# Altium schematic sheet PART5_HPI_McBSP.SchDoc: 接口及解码设计
size A3; Author: 崔 敖; 李尚文; Revision: B1.0; SheetNumber: 5
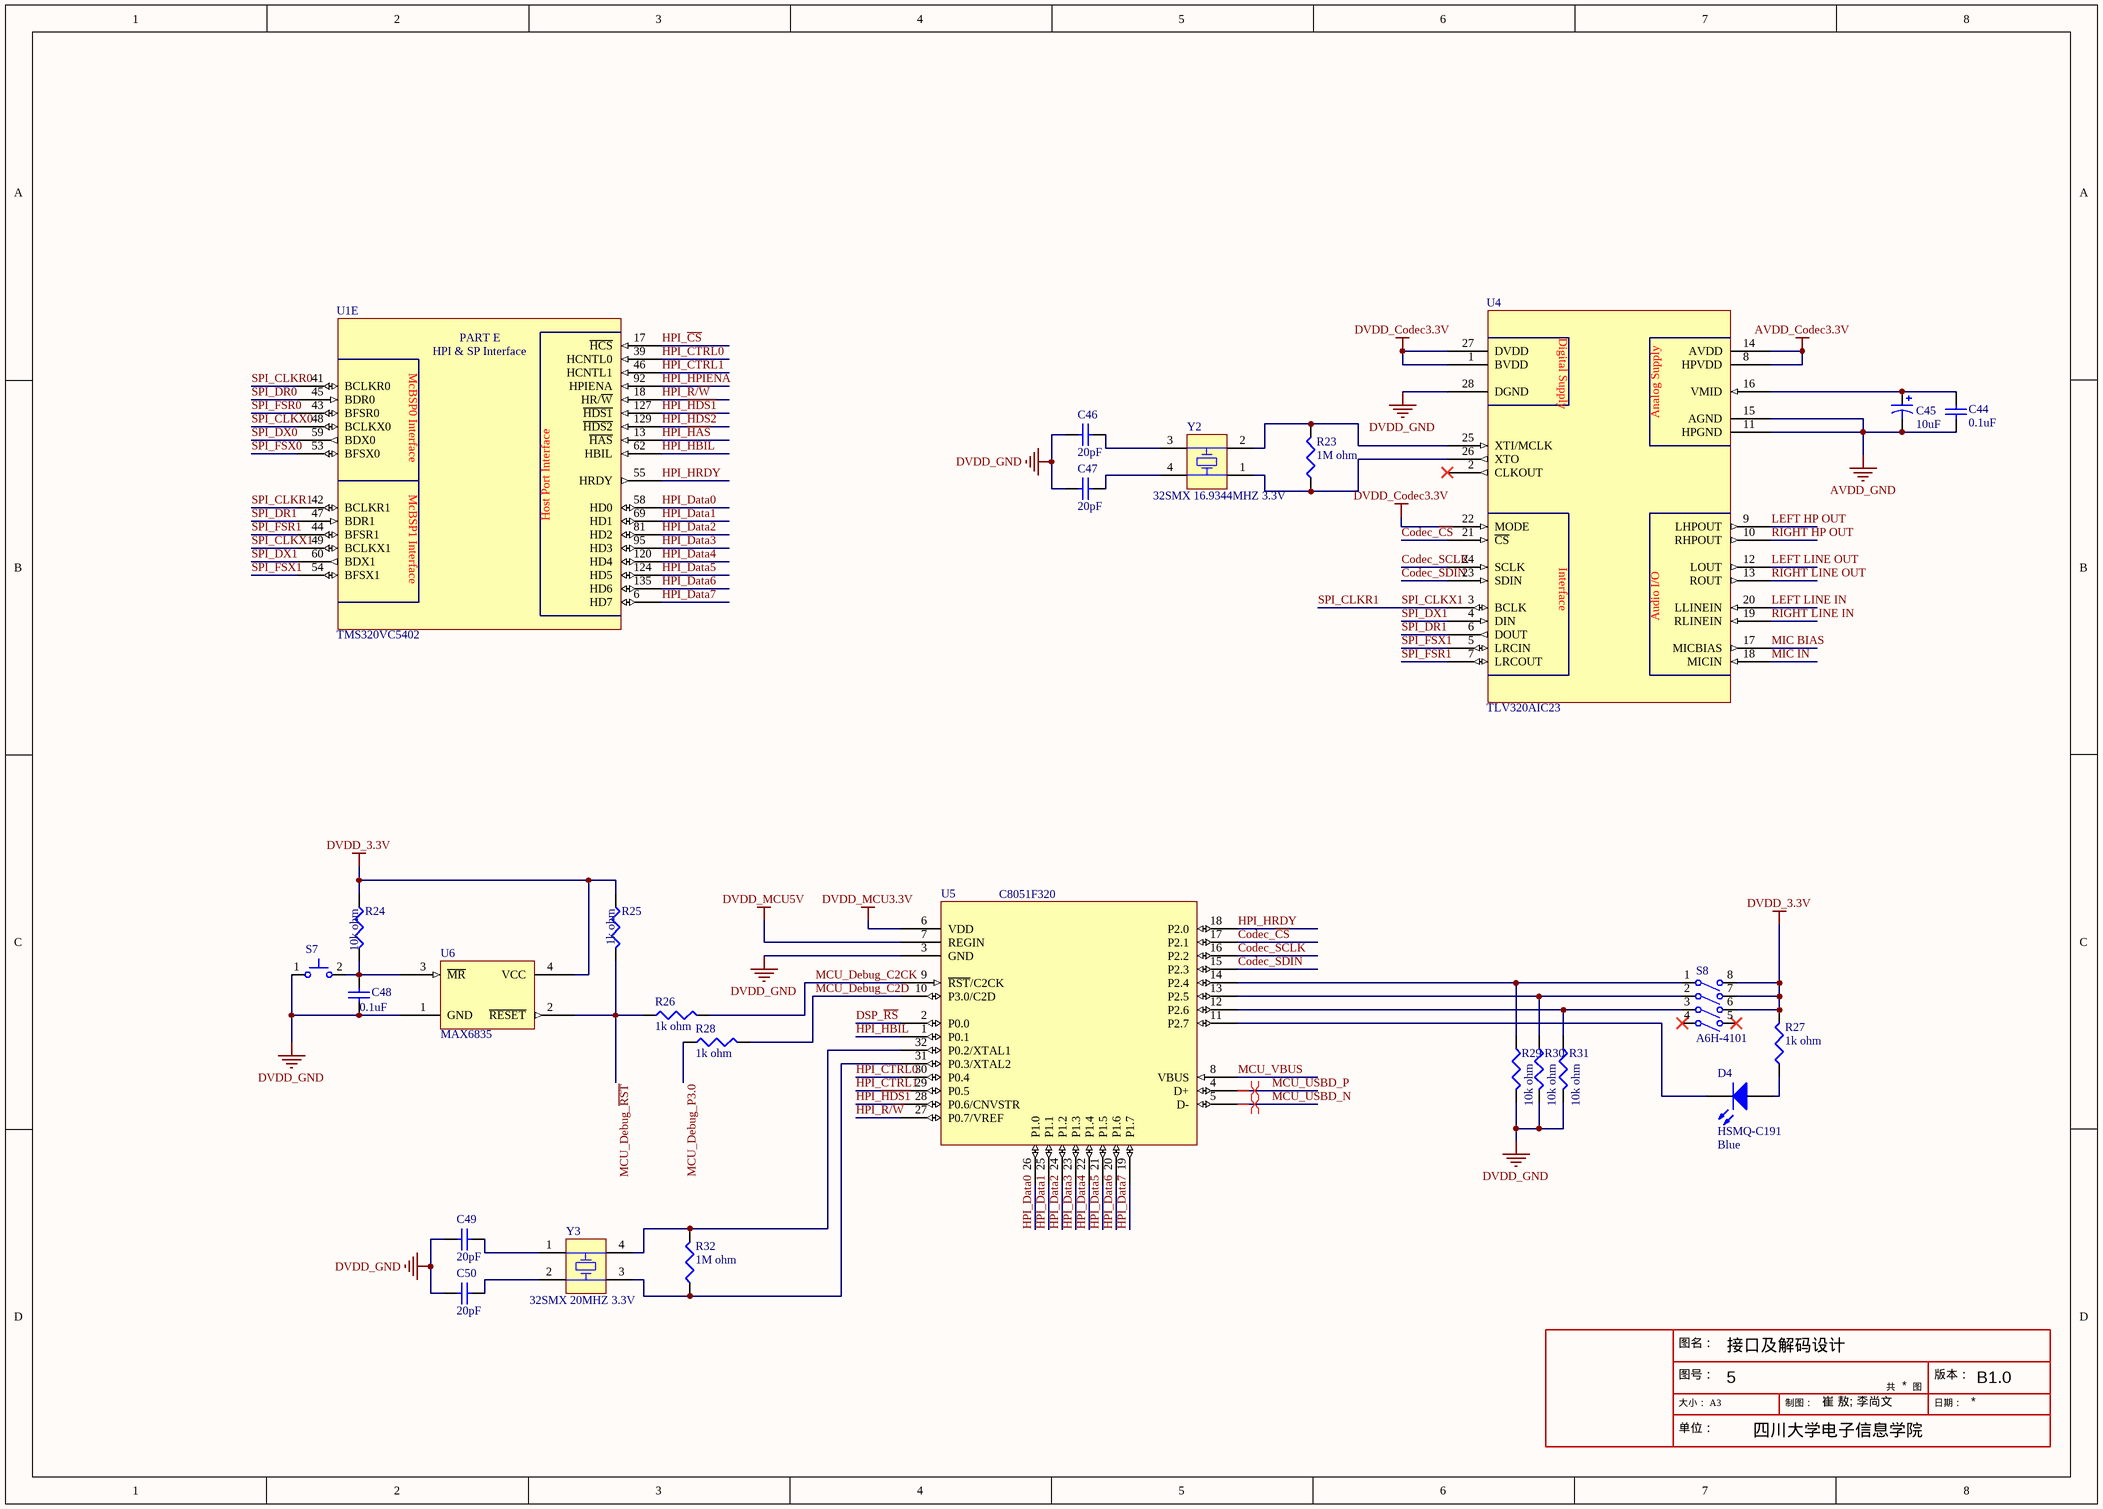
[diagram p0: PART5_HPI_McBSP.SchDoc]

## Parts
C44  value 0.1uF  [1608[0603]]  (hidden comment: Cap Semi)
C45  value 10uF  [C0805]  (hidden comment: Cap Tan)
C46  value 20pF  [1608[0603]]  (hidden comment: Cap Semi)
C47  value 20pF  [1608[0603]]  (hidden comment: Cap Semi)
C48  value 0.1uF  [1608[0603]]  (hidden comment: Cap Semi)
C49  value 20pF  [1608[0603]]  (hidden comment: Cap Semi)
C50  value 20pF  [1608[0603]]  (hidden comment: Cap Semi)
D4  HSMQ-C191  LED_Colour: Blue  [1.6X0.8X0.6]
R23  value 1M ohm  [J1-0603]  (hidden comment: Res3)
R24  value 10k ohm  [J1-0603]  (hidden comment: Res3)
R25  value 1k ohm  [J1-0603]  (hidden comment: Res3)
R26  value 1k ohm  [J1-0603]  (hidden comment: Res3)
R27  value 1k ohm  [J1-0603]  (hidden comment: Res3)
R28  value 1k ohm  [J1-0603]  (hidden comment: Res3)
R29  value 10k ohm  [J1-0603]  (hidden comment: Res3)
R30  value 10k ohm  [J1-0603]  (hidden comment: Res3)
R31  value 10k ohm  [J1-0603]  (hidden comment: Res3)
R32  value 1M ohm  [J1-0603]  (hidden comment: Res3)
S7  KSS221GLFS  [KSS-2G]  (value not drawn)
S8  A6H-4101  [A6H-4]
U1  TMS320VC5402  [TMS320VC5401_PQFP144]  (part E of 5)
U4  TLV320AIC23  [TSOP65P640X120-28N]
U5  C8051F320  [TQFP80P900X900X160-32N]
U6  MAX6835  [SC70-4]
Y2  32SMX 16.9344MHZ 3.3V  [32SMX]
Y3  32SMX 20MHZ 3.3V  [32SMX]

## Nets
AVDD_Codec3.3V: U4.8(HPVDD) U4.14(AVDD)
AVDD_GND: C44.2 C45.2 U4.11(HPGND) U4.15(AGND)
DVDD_3.3V: R24.1 R25.1 R27.2 S8.6(B3) S8.7(B2) S8.8(B1) U6.4(VCC)
DVDD_Codec3.3V: U4.1(BVDD) U4.22(MODE) U4.27(DVDD)
DVDD_GND: C46.2 C47.2 C48.2 C49.2 C50.2 R29.2 R30.2 R31.2 S7.1 U4.28(DGND) U5.3(GND) U6.1(GND)
DVDD_MCU3.3V: U5.6(VDD)
DVDD_MCU5V: U5.7(REGIN)
Codec_~{CS}: U4.21(~{CS}) U5.17(P2.1)
Codec_SCLK: U4.24(SCLK) U5.16(P2.2)
Codec_SDIN: U4.23(SDIN) U5.15(P2.3)
DSP_~{RS}: U5.2(P0.0)
HPI_~{CS}: U1.17(~{HCS})
HPI_CTRL0: U1.39(HCNTL0) U5.30(P0.4)
HPI_CTRL1: U1.46(HCNTL1) U5.29(P0.5)
HPI_Data0: U1.58(HD0) U5.26(P1.0)
HPI_Data1: U1.69(HD1) U5.25(P1.1)
HPI_Data2: U1.81(HD2) U5.24(P1.2)
HPI_Data3: U1.95(HD3) U5.23(P1.3)
HPI_Data4: U1.120(HD4) U5.22(P1.4)
HPI_Data5: U1.124(HD5) U5.21(P1.5)
HPI_Data6: U1.135(HD6) U5.20(P1.6)
HPI_Data7: U1.6(HD7) U5.19(P1.7)
HPI_~{HAS}: U1.13(~{HAS})
HPI_~{HDS1}: U1.127(~{HDS1}) U5.28(P0.6/CNVSTR)
HPI_~{HDS2}: U1.129(~{HDS2})
HPI_HBIL: U1.62(HBIL) U5.1(P0.1)
HPI_HPIENA: U1.92(HPIENA)
HPI_HRDY: U1.55(HRDY) U5.18(P2.0)
HPI_R/~{W}: U1.18(HR/~{W}) U5.27(P0.7/VREF)
LEFT HP OUT: U4.9(LHPOUT)
LEFT LINE IN: U4.20(LLINEIN)
LEFT LINE OUT: U4.12(LOUT)
MCU_Debug_C2CK: R26.2 U5.9(~{RST}/C2CK)
MCU_Debug_C2D: R28.2 U5.10(P3.0/C2D)
MCU_Debug_P3.0: R28.1
MCU_Debug_~{RST}: R25.2 R26.1 U6.2(~{RESET})
MCU_USBD_N: U5.5(D-)
MCU_USBD_P: U5.4(D+)
MCU_VBUS: U5.8(VBUS)
MIC BIAS: U4.17(MICBIAS)
MIC IN: U4.18(MICIN)
RIGHT HP OUT: U4.10(RHPOUT)
RIGHT LINE IN: U4.19(RLINEIN)
RIGHT LINE OUT: U4.13(ROUT)
SPI_CLKR0: U1.41(BCLKR0)
SPI_CLKR1: U1.42(BCLKR1) U1.49(BCLKX1) U4.3(BCLK)  [also labelled SPI_CLKX1]
SPI_CLKX0: U1.48(BCLKX0)
SPI_DR0: U1.45(BDR0)
SPI_DR1: U1.47(BDR1) U4.6(DOUT)
SPI_DX0: U1.59(BDX0)
SPI_DX1: U1.60(BDX1) U4.4(DIN)
SPI_FSR0: U1.43(BFSR0)
SPI_FSR1: U1.44(BFSR1) U4.7(LRCOUT)
SPI_FSX0: U1.53(BFSX0)
SPI_FSX1: U1.54(BFSX1) U4.5(LRCIN)
NetC44_1: C44.1 C45.1 U4.16(VMID)
NetC46_1: C46.1 Y2.3(OSC2)
NetC47_1: C47.1 Y2.4(OSC1)
NetC48_1: C48.1 R24.2 S7.2 U6.3(~{MR})
NetC49_1: C49.1 Y3.1(OSC1)
NetC50_1: C50.1 Y3.2(OSC2)
NetD4_1: D4.1(A) R27.1
NetD4_2: D4.2(K) U5.11(P2.7)
NetR23_1: R23.1 U4.26(XTO) Y2.1(OSC1)
NetR23_2: R23.2 U4.25(XTI/MCLK) Y2.2(OSC2)
NetR29_1: R29.1 S8.1(A1) U5.14(P2.4)
NetR30_1: R30.1 S8.2(A2) U5.13(P2.5)
NetR31_1: R31.1 S8.3(A3) U5.12(P2.6)
NetR32_1: R32.1 U5.31(P0.3/XTAL2) Y3.3(OSC2)
NetR32_2: R32.2 U5.32(P0.2/XTAL1) Y3.4(OSC1)

Not connected (* = marked no-connect by the designer): S8 4(A4)* 5(B4)*; U4 2(CLKOUT)*

## Layout directives
differential pair: MCU_USBD_N, MCU_USBD_P

## Notes on the sheet
- 图名：
- 图号：
- 共
- 图
- 版本：
- 大小： A3
- 单位：
- 四川大学电子信息学院
- 制图：
- 日期：
- (in symbol TLV320AIC23) Digital Supply; Analog Supply; Interface; Audio I/O
- (in symbol TMS320VC5402, part E) PART E; HPI & SP Interface; McBSP0 Interface; McBSP1 Interface; Host Port Interface

## Library data of the parts
C44 C46-C50 = Cap Semi: 贴片电容 1608; Published: 8-Jun-2000; LatestRevisionDate: 29-May-2009; LatestRevisionNote: IPC-7351 Footprint Added.; PackageReference: C1206; Publisher: Altium Limited; PackageDescription: Chip Capacitor
C45 = Cap Pol3: 贴片钽电容 C0805; Published: 8-Jun-2000; LatestRevisionDate: 29-May-2009; LatestRevisionNote: IPC-7351 Footprint Added.; PackageReference: C0805; Publisher: Altium Limited; PackageDescription: Chip Capacitor
D4 = HSMQ-C191: Top Mount Low Profile Chip LED, Green; LuminousIntensity: 40mcd (Minimum).; PCB_Layout: Complies with manufacturer's recommendation.; Published: 11-Dec-2002; DatasheetDocument: 6-Apr-2002; PackageDocument: 11-Mar-2002; PackageReference: 1.6X0.8X0.6; Publisher: Altium Limited; ComponentLink1Description: Manufacturer Link; ComponentLink1URL: http://www.agilent.com/; ComponentLink2Description: Datasheet; ComponentLink2URL: http://cp.literature.agilent.com/litweb/pdf/5988-4832EN.pdf
R23-R32 = Res3: 贴片电阻 0603; Published: 8-Jun-2000; LatestRevisionDate: 29-May-2009; LatestRevisionNote: IPC-7351 Footprint Added.; PackageReference: J1-0603; Publisher: Altium Limited; PackageDescription: Chip Resistor
S7 = KSS221GLFS: Switch, Subminiature Side-Actuated Tact, SMT, KSS Series, Std Actuator, 2 Gull Wing Leads, SPST, 2N Force, Silver Contact; PCB_Layout: Complies with manufacturer's recommendation.; Published: 14-Mar-2008; DatasheetVersion: Aug-2007; PackageVersion: Aug-2007; PackageReference: KSS-2G; Publisher: Altium Limited; PackageDescription: Subminiature SMT Side Actuated Switch, Body 7 x 3.5 mm (LxW); ComponentLink1Description: Manufacturer Link; ComponentLink1URL: http://www.ck-components.com/; ComponentLink2Description: Datasheet; ComponentLink2URL: http://www.ck-components.com/media/pdf/catalogs/Tactile_Switches%5CKSS_series_Tactile_August_2007.pdf
S8 = A6H-4101: Ultra-Low Profile, Half-Pitch, SM, Slide DIP Switch, Flat Actuator, White Striker, 4 Position, SPST, Std. Model; PCB_Layout: Complies with manufacturer's recommendation.; Published: 14-Mar-2008; DatasheetVersion: Jul-2007; PackageVersion: Jul-2007; PackageReference: A6H-4; Publisher: Altium Limited; PackageDescription: Slide DIP Switch; SM; 4 Position SPST; Body 6.31 x 4.5 mm (LxW); Pitch 1.27mm; ComponentLink1Description: Manufacturer Link; ComponentLink1URL: http://www.omron.com/; ComponentLink2Description: Datasheet; ComponentLink2URL: http://www.omron.com/ecb/products/pdf/en-a6h.pdf
Y2 Y3 = 32SMX: Surface Mount Quartz Crystal; Note: PCB layout complies with manufacturer's recommendation.; Published: 17-Jul-2002; DatasheetDocument: 30-Jul-1999; PackageDocument: 30-Jul-1999; PackageReference: 32SMX; Publisher: Altium Limited; ComponentLink1Description: Manufacturer Link; ComponentLink1URL: http://www.cmac.com/mt/